# EAGLE design readerboard_avr8 (EAGLE 5.11)
REVISION: 20120727
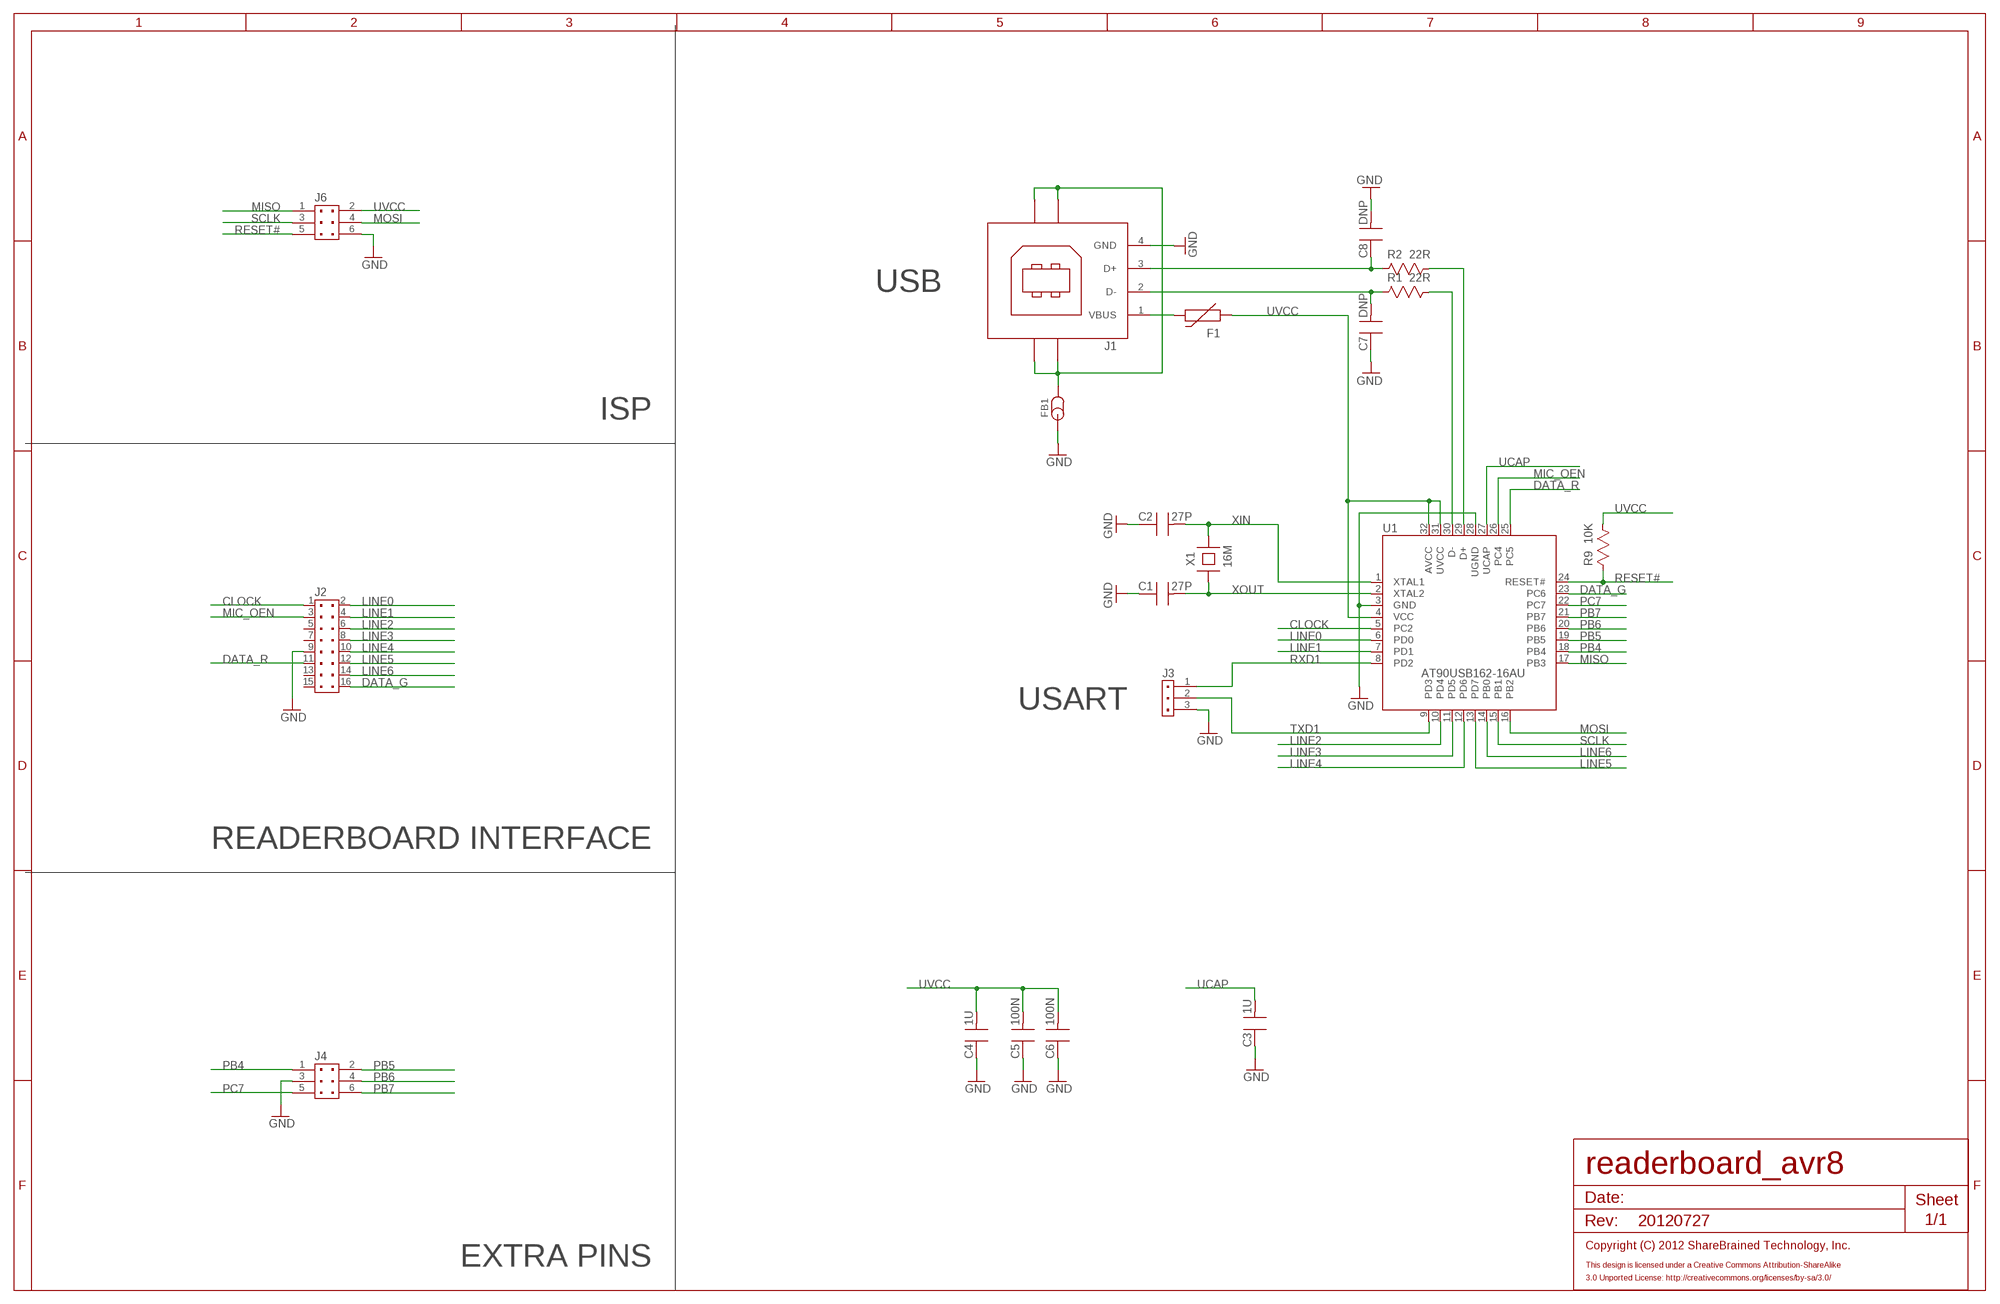
[diagram p0: schematic, sheet 1]

## Parts
C1  27P  C0603_90  [CAPC1608X90N]
C2  27P  C0603_90  [CAPC1608X90N]
C3  1U  C0603_90  [CAPC1608X90N]
C4  1U  C0603_90  [CAPC1608X90N]
C5  100N  C0603_90  [CAPC1608X90N]
C6  100N  C0603_90  [CAPC1608X90N]
C7  DNP  C0603_90  [CAPC1608X90N]
C8  DNP  C0603_90  [CAPC1608X90N]
F1  FUSE_BOURNS_MF-NSMF050  [BOURNS_MF-NSMF]
FB1  FB0603  [INDC1608X95N]
J1  USB_B_WURTH_61400413321  USB_B_OST_USB-B1KS  [USB_B_VERTICAL]
J2  HEADER2X8TH-254  [HEADER254P2X8]
J3  HEADER1X3TH-254  [HEADER254P1X3]
J4  HEADER2X3TH-254  [HEADER254P2X3]
J6  HEADER2X3TH-254  [HEADER254P2X3]
R1  22R  R0603_55  [RESC1608X55N]
R2  22R  R0603_55  [RESC1608X55N]
R9  10K  R0603_55  [RESC1608X55N]
U1  AT90USB162-16AU  [QFP80P900X900X120-32N]
X1  16M  X_HC49US  [HC-49/U-S]

## Nets
CLOCK: J2.1 U1.5(PC2)
DATA_G: J2.16 U1.23(PC6)
DATA_R: J2.11 U1.25(PC5)
GND: C1.1 C2.1 C3.1 C4.1 C5.1 C6.1 C7.1 C8.2 FB1.1 J1.4(GND) J2.9 J3.3 J4.3 J6.6 U1.3(GND) U1.28(UGND)
LINE0: J2.2 U1.6(PD0)
LINE1: J2.4 U1.7(PD1)
LINE2: J2.6 U1.10(PD4)
LINE3: J2.8 U1.11(PD5)
LINE4: J2.10 U1.12(PD6)
LINE5: J2.12 U1.13(PD7)
LINE6: J2.14 U1.14(PB0)
MIC_OEN: J2.3 U1.26(PC4)
MISO: J6.1 U1.17(PB3)
MOSI: J6.4 U1.16(PB2)
N$2: R1.2 U1.30(D-)
N$3: R2.2 U1.29(D+)
N$4: C8.1 J1.3(D+) R2.1
N$5: C7.2 J1.2(D-) R1.1
N$14: FB1.2 J1.SHIELD@1(SHIELD) J1.SHIELD@2(SHIELD) J1.SHIELD@3(SHIELD) J1.SHIELD@4(SHIELD)
PB4: J4.1 U1.18(PB4)
PB5: J4.2 U1.19(PB5)
PB6: J4.4 U1.20(PB6)
PB7: J4.6 U1.21(PB7)
PC7: J4.5 U1.22(PC7)
RESET#: J6.5 R9.1 U1.24(RESET#)
RXD1: J3.1 U1.8(PD2)
SCLK: J6.3 U1.15(PB1)
TXD1: J3.2 U1.9(PD3)
UCAP: C3.2 U1.27(UCAP)
UVCC: C4.2 C5.2 C6.2 F1.1 J6.2 R9.2 U1.4(VCC) U1.31(UVCC) U1.32(AVCC)
VUSB: F1.2 J1.1(VBUS)
XIN: C2.2 U1.1(XTAL1) X1.2
XOUT: C1.2 U1.2(XTAL2) X1.1
Unconnected: J2.5 J2.7 J2.13 J2.15

## Notes on the sheet
- USB
- ISP
- USART
- READERBOARD INTERFACE
- EXTRA PINS

## Library data of the parts
C1-C8 = capacitor:C
F1 = fuse:FUSE?*
FB1 = inductor:FB
J1 = usb:USB_B
J2 = stake:HEADER2X8
J3 = stake:HEADER1X3
J4 J6 = stake:HEADER2X3
R1 R2 R9 = resistor:R
U1 = atmel:AT90USB*?AU
X1 = crystal:X

## Board
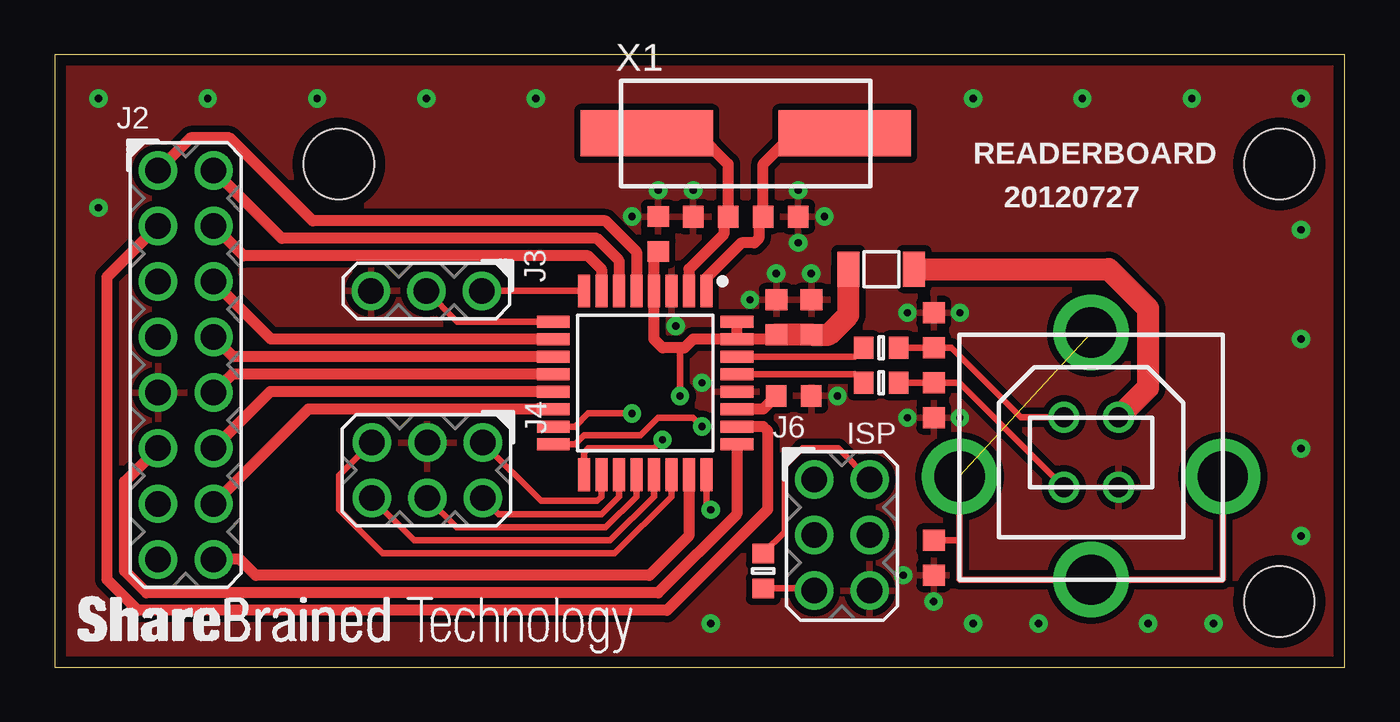
[diagram p1: board, top side]
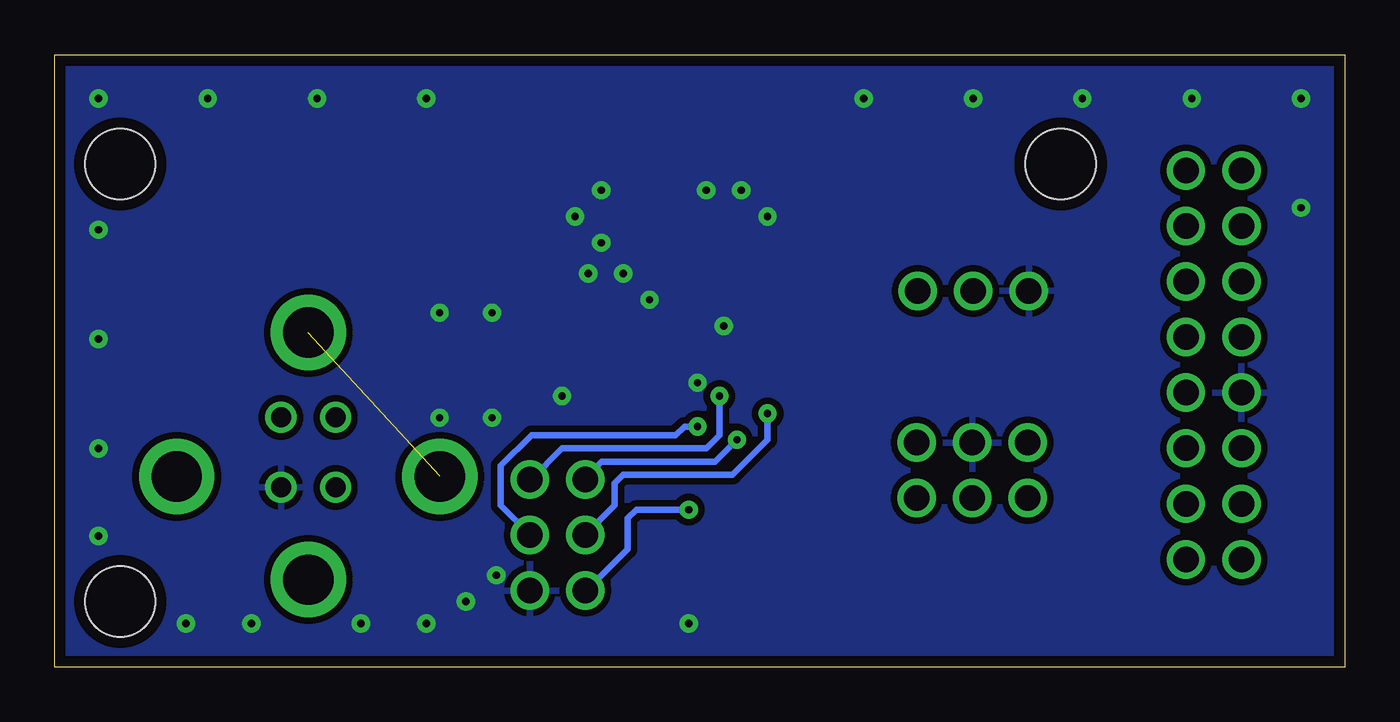
[diagram p2: board, bottom side, seen from below]

Size 59 x 28 mm. Coordinates in mm from the lower left corner, seen from the top.
Outline: 0,0 59,0 59,28 0,28 0,0
Copper layers (1+16): Top 0.0356mm / dielectric 1.5mm / Bottom 0.0356mm
Design rules "laen-two-max *": minimum track width 0.3mm, minimum drill 16mil, track to track 0.25mm, track to pad 0.25mm, pad to pad 0.25mm, via to via 0.25mm, smd to smd 0.25mm, copper to edge 20mil, drill to drill 16mil, minimum pad ring 10mil, minimum via ring 10mil, stop-mask expansion 3mil, vias tented up to drill 16mil, thermal gap 0.3mm
Holes 3.2 mm at 13,23 56,3 56,23

### Footprints (pad centres in the part's own frame; a part is rotated, then mirrored left to right if it is on the bottom)
CAPC1608X90N = smd 0.95 x 1: 1 -0.8,0; 2 0.8,0
BOURNS_MF-NSMF = smd 1 x 1.6: 1 -1.5,0; 2 1.5,0
INDC1608X95N = smd 0.95 x 1: 1 -0.8,0; 2 0.8,0
USB_B_VERTICAL = drill 0.92 round: 1 1.25,1.82; 2 -1.25,1.82; 3 -1.25,-1.38; 4 1.25,-1.38 | drill 2.3 round: SHIELD@1 -6.02,-0.88; SHIELD@2 6.02,-0.88; SHIELD@3 0,5.7; SHIELD@4 0,-5.6
HEADER254P2X8 = drill 1.168 round: 1 -1.27,8.91; 2 1.27,8.91; 3 -1.27,6.37; 4 1.27,6.37; 5 -1.27,3.83; 6 1.27,3.83; 7 -1.27,1.29; 8 1.27,1.29; 9 -1.27,-1.25; 10 1.27,-1.25; 11 -1.27,-3.79; 12 1.27,-3.79; 13 -1.27,-6.33; 14 1.27,-6.33; 15 -1.27,-8.87; 16 1.27,-8.87
HEADER254P1X3 = drill 1.168 round: 1 0,2.54; 2 0,0; 3 0,-2.54
HEADER254P2X3 = drill 1.168 round: 1 -1.27,2.58; 2 1.27,2.58; 3 -1.27,0.04; 4 1.27,0.04; 5 -1.27,-2.5; 6 1.27,-2.5
RESC1608X55N = smd 0.9 x 1: 1 -0.8,0; 2 0.8,0
QFP80P900X900X120-32N = smd 1.5 x 0.55: 1 -4.2,2.8; 2 -4.2,2; 3 -4.2,1.2; 4 -4.2,0.4; 5 -4.2,-0.4; 6 -4.2,-1.2; 7 -4.2,-2; 8 -4.2,-2.8; 17 4.2,-2.8; 18 4.2,-2; 19 4.2,-1.2; 20 4.2,-0.4; 21 4.2,0.4; 22 4.2,1.2; 23 4.2,2; 24 4.2,2.8 | smd 0.55 x 1.5: 9 -2.8,-4.2; 10 -2,-4.2; 11 -1.2,-4.2; 12 -0.4,-4.2; 13 0.4,-4.2; 14 1.2,-4.2; 15 2,-4.2; 16 2.8,-4.2; 25 2.8,4.2; 26 2,4.2; 27 1.2,4.2; 28 0.4,4.2; 29 -0.4,4.2; 30 -1.2,4.2; 31 -2,4.2; 32 -2.8,4.2
HC-49/U-S = smd 6.05 x 2.1: 1 -4.525,0; 2 4.525,0

### Placement (x,y rotation side)
C1  30,20.6 0 top
C2  33.2,20.6 180 top
C3  33.8,12.4 180 top
C4  34.6,16 270 top
C5  33,16 270 top
C6  27.6,19.8 270 top
C7  40.2,15.4 270 top
C8  40.2,12.2 270 top
F1  37.8,18.2 0 top
FB1  40.2,5 90 top
J1  47.4,9.6 0 top
J2  6,13.8 0 top
J3  17,17.2 270 top
J4  17,9 270 top
J6  36,6 0 top
R1  37.8,14.6 180 top
R2  37.8,13 180 top
R9  32.4,4.4 90 top
U1  27,13 270 top
U$4  [NAME_1000_500]  13.2,2 0 top
X1  31.6,24.4 0 top

### Tracks (layer width: path | path; a pad name or v marks a point on that pad's centre or on a via)
CLOCK
  Top 0.5: U1.5 26.6,19 25.2,20.4 11.8,20.4 8,24.2 6.22,24.2 J2.1
DATA_G
  Top 0.5: U1.23 29,6 27.2,4.2 9.2,4.2 8.47,4.93 J2.16
DATA_R
  Top 0.5: U1.25 31.2,7 27.6,3.4 4.2,3.4 3.2,4.4 3.2,8.48 J2.11
GND  (via drill 0.33)
  other vias: 28.4,15.6 29.6,13 38.8,4.2 40.2,3 34.6,18 33,18 31.8,16.8 34,21.8 34,19.4 35.2,20.6 29.2,21.8 27.6,21.8 26.4,20.6 35.8,12.4 2,26 7,26 12,26 17,26 22,26 2,21 57,26 52,26 47,26 42,26 57,20 57,15 57,10 57,6 53,2 50,2 45,2 42,2 30,2 39,11.4 39,16.2 41.4,16.2 41.4,11.4
  pour Bottom (isolate 0.3, rank 2): 0,0 0,28 59,28 59,0
  pour Top (isolate 0.3): 0,0 0,28 59,28 59,0
LINE0
  Top 0.5: U1.6 25.8,18.6 24.8,19.6 10.38,19.6 J2.2
LINE1
  Top 0.5: U1.7 25,18.2 24.4,18.8 8.64,18.8 J2.4
LINE2
  Top 0.5: U1.10 9.9,15 J2.6
LINE3
  Top 0.5: U1.11 8.16,14.2 J2.8
LINE4
  Top 0.5: U1.12 8.12,13.4 J2.10
LINE5
  Top 0.5: U1.13 9.86,12.6 J2.12
LINE6
  Top 0.5: U1.14 11.6,11.8 J2.14
MIC_OEN
  Top 0.5: U1.26 32.4,11 32.6,10.8 32.6,7.2 28,2.6 3.8,2.6 2.4,4 2.4,17.84 J2.3
MISO  (via drill 0.33)
  Top 0.3: U1.17 24.2,9.8 24.4,10 27.4,10 v27.8,10.4
  Bottom 0.3: J6.1 34.73,8.67 34,9.4 28.8,9.4 v27.8,10.4
MOSI  (via drill 0.33)
  Top 0.3: U1.16 23.8,10.2 24.2,10.6 26.8,10.6 27.6,11.4 29.2,11.4 v29.6,11
  Bottom 0.3: J6.4 37.27,6.07 38.6,7.4 38.6,9.2 37.2,10.6 30.6,10.6 30.2,11 v29.6,11
N$2
  Top 0.3: U1.30 36.6,14.2 R1.2
N$3
  Top 0.3: U1.29 36.6,13.4 R2.2
N$4
  Top 0.3: R2.1 C8.1 41.37,13 J1.3
N$5
  Top 0.3: R1.1 C7.2 41,14.6 44.18,11.42 J1.2
N$14  (1 unrouted)
  Top 0.3: 41.38,5.8 41.38,4.02 41.4,4 J1.SHIELD@4 53.4,4 53.42,4.02 J1.SHIELD@2 | 41.38,5.8 J1.SHIELD@1 | 41.38,5.8 FB1.2
PB4
  Top 0.3: U1.18 25,7.8 24.8,7.6 22.25,7.6 J4.1
PB5
  Top 0.3: U1.19 25.8,7.8 25,7 20.31,7 J4.2
PB6
  Top 0.3: U1.20 26.6,7.8 25.2,6.4 18.37,6.4 J4.4
PB7
  Top 0.3: U1.21 27.4,7.8 25.4,5.8 16.43,5.8 J4.6
PC7
  Top 0.3: U1.22 28.2,7.8 25.6,5.2 15,5.2 13,7.2 13,8.77 J4.5
RESET#  (via drill 0.33)
  Top 0.3: U1.24 29.8,7.4 v30,7.2 | R9.1 34.63,3.6 J6.5
  Bottom 0.3: J6.5 34.7,3.5 32.8,5.4 32.8,6.8 32.4,7.2 v30,7.2
RXD1
  Top 0.3: U1.8 J3.1
SCLK  (via drill 0.33)
  Top 0.3: U1.15 23.8,11 24.4,11.6 v26.4,11.6
  Bottom 0.3: J6.3 34.73,6.07 33.4,7.4 33.4,8.4 33,8.8 28,8.8 26.4,10.4 v26.4,11.6
TXD1
  Top 0.3: U1.9 18.4,15.8 J3.2
UCAP
  Top 0.5: U1.27 32.4,11.8 C3.2
UVCC  (via drill 0.33)
  Top 0.3: 28.6,14.6 v28.6,12.4 | R9.2 33.4,6.2 33.4,9.2 34.2,10 35.85,10 J6.2
  Top 0.5: C6.2 27.4,18.8 U1.4 27.4,15 27.8,14.6 28.6,14.6 28.8,14.6 29.2,15 U1.31 | U1.31 U1.32 | U1.31 32.8,15 C5.2
  Top 1: C5.2 C4.2 35.4,15.2 36.3,16.1 F1.1
  Bottom 0.3: J6.2 37.22,8.58 35.8,10 29.2,10 28.6,10.6 v28.6,12.4
VUSB
  Top 1: F1.2 48.2,18.2 50,16.4 50,12.77 J1.1
XIN
  Top 0.5: U1.1 29.8,17.8 31.4,19.4 32,19.4 32.2,19.6 32.2,20.4 C2.2 32.4,23 33.8,24.4 X1.2
XOUT
  Top 0.5: U1.2 29,18.2 30.6,19.8 30.6,20.4 C1.2 30.8,23 29.4,24.4 X1.1

### Text on the board
tPlace: READERBOARD | 20120727 | ISP